# EAGLE design MainBoard (EAGLE 9.6.2)
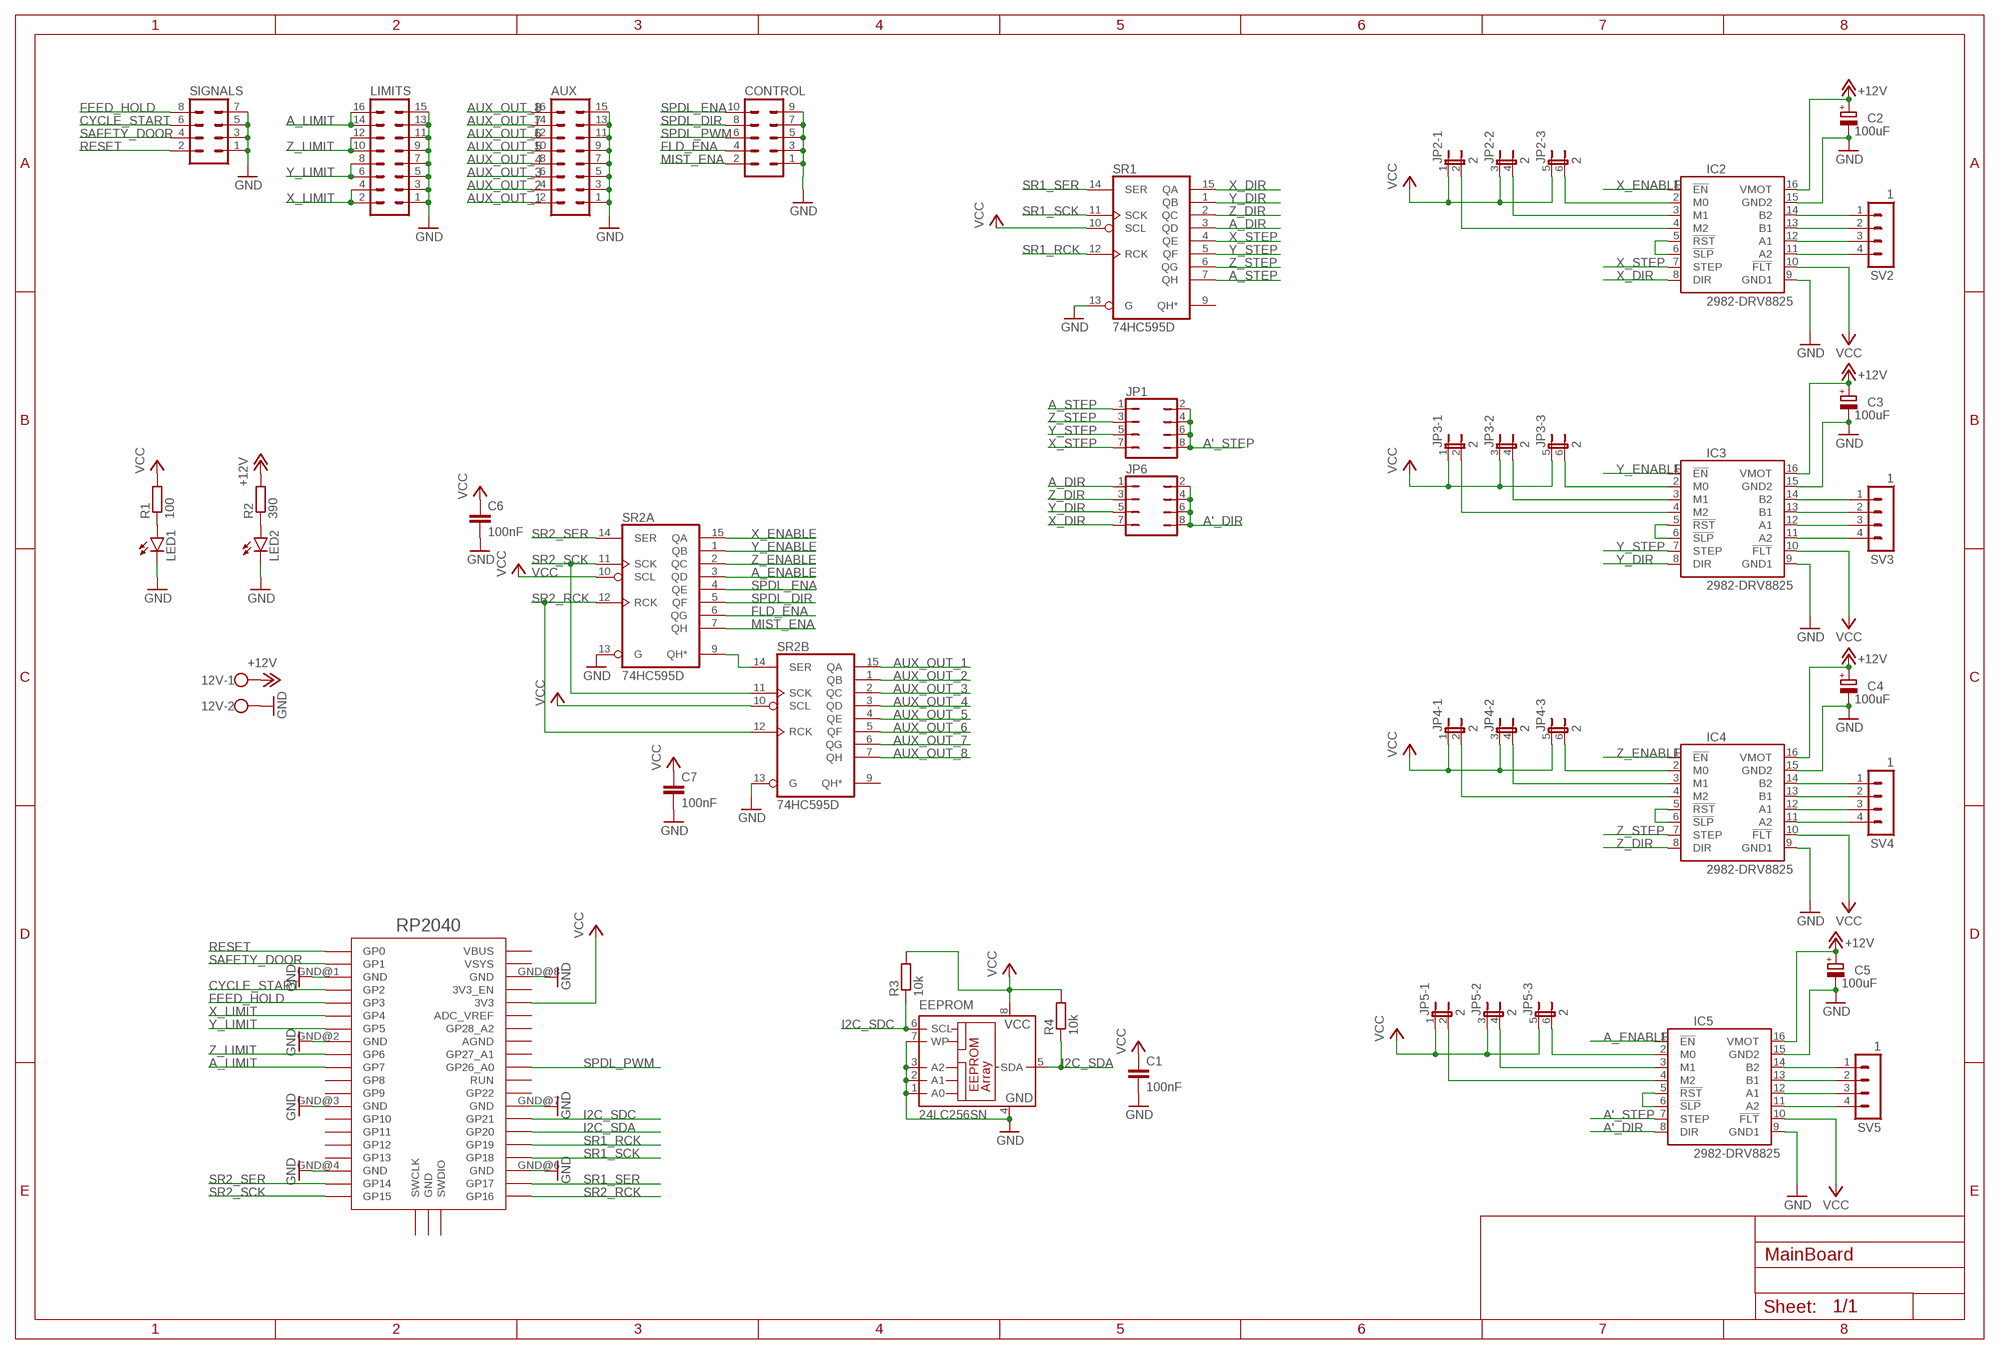
[diagram p0: schematic, sheet 1]

## Parts
12V  W237-102  [W237-102]
AUX  MA08-2  [MA08-2]
C1  100nF  C-EUC0805  [C0805]
C2  100uF  CPOL-EUE3.5-8  [E3,5-8]
C3  100uF  CPOL-EUE3.5-8  [E3,5-8]
C4  100uF  CPOL-EUE3.5-8  [E3,5-8]
C5  100uF  CPOL-EUE3.5-8  [E3,5-8]
C6  100nF  C-EUC0805  [C0805]
C7  100nF  C-EUC0805  [C0805]
CONTROL  MA05-2  [MA05-2]
EEPROM  24LC256SN  [SO-08]
IC2  2982-DRV8825  [DRV8825]
IC3  2982-DRV8825  [DRV8825]
IC4  2982-DRV8825  [DRV8825]
IC5  2982-DRV8825  [DRV8825]
JP1  JP4Q  [JP4Q]
JP2  2  JP3QE  [JP3Q]
JP3  2  JP3QE  [JP3Q]
JP4  2  JP3QE  [JP3Q]
JP5  2  JP3QE  [JP3Q]
JP6  JP4Q  [JP4Q]
LED1  LEDCHIP-LED0805  [CHIP-LED0805]
LED2  LEDCHIP-LED0805  [CHIP-LED0805]
LIMITS  MA08-2  [MA08-2]
R1  100  R-EU_R0805  [R0805]
R2  390  R-EU_R0805  [R0805]
R3  10k  R-EU_R0805  [R0805]
R4  10k  R-EU_R0805  [R0805]
RP2040  RPI_PICO_IG-TH  [RPI_PICO_TH]
SIGNALS  MA04-2  [MA04-2]
SR1  74HC595D  [SO16]
SR2A  74HC595D  [SO16]
SR2B  74HC595D  [SO16]
SV2  1  MA04-1  [MA04-1]
SV3  1  MA04-1  [MA04-1]
SV4  1  MA04-1  [MA04-1]
SV5  1  MA04-1  [MA04-1]

## Nets
+12V [VCC_12]: 12V.1 C2.+ C3.+ C4.+ C5.+ IC2.16(VMOT) IC3.16(VMOT) IC4.16(VMOT) IC5.16(VMOT) R2.2
A'_DIR: IC5.8(DIR) JP6.2 JP6.4 JP6.6 JP6.8
A'_STEP: IC5.7(STEP) JP1.2 JP1.4 JP1.6 JP1.8
A_DIR: JP6.1 SR1.3(QD)
A_ENABLE: IC5.1(!EN) SR2A.3(QD)
A_LIMIT: LIMITS.14 LIMITS.16 RP2040.GP7
A_STEP: JP1.1 SR1.7(QH)
AUX_OUT_1: AUX.2 SR2B.15(QA)
AUX_OUT_2: AUX.4 SR2B.1(QB)
AUX_OUT_3: AUX.6 SR2B.2(QC)
AUX_OUT_4: AUX.8 SR2B.3(QD)
AUX_OUT_5: AUX.10 SR2B.4(QE)
AUX_OUT_6: AUX.12 SR2B.5(QF)
AUX_OUT_7: AUX.14 SR2B.6(QG)
AUX_OUT_8: AUX.16 SR2B.7(QH)
CYCLE_START: RP2040.GP2 SIGNALS.6
FEED_HOLD: RP2040.GP3 SIGNALS.8
FLD_ENA: CONTROL.4 SR2A.6(QG)
GND: 12V.2 AUX.1 AUX.3 AUX.5 AUX.7 AUX.9 AUX.11 AUX.13 AUX.15 C1.2 C2.- C3.- C4.- C5.- C6.2 C7.2 CONTROL.1 CONTROL.3 CONTROL.5 CONTROL.7 CONTROL.9 EEPROM.1(A0) EEPROM.2(A1) EEPROM.3(A2) EEPROM.4(GND) EEPROM.7(WP) IC2.9(GND1) IC2.15(GND2) IC3.9(GND1) IC3.15(GND2) IC4.9(GND1) IC4.15(GND2) IC5.9(GND1) IC5.15(GND2) LED1.C LED2.C LIMITS.1 LIMITS.3 LIMITS.5 LIMITS.7 LIMITS.9 LIMITS.11 LIMITS.13 LIMITS.15 RP2040.GND@1(GND) RP2040.GND@2(GND) RP2040.GND@3(GND) RP2040.GND@4(GND) RP2040.GND@6(GND) RP2040.GND@7(GND) RP2040.GND@8(GND) SIGNALS.1 SIGNALS.3 SIGNALS.5 SIGNALS.7 SR1.13(G) SR2A.13(G) SR2B.13(G)
I2C_SDA: EEPROM.5(SDA) R4.1 RP2040.GP20
I2C_SDC: EEPROM.6(SCL) R3.1 RP2040.GP21
M0-X: IC2.2(M0) JP2.6
M1-X: IC2.3(M1) JP2.4
M2-X: IC2.4(M2) JP2.2
MIST_ENA: CONTROL.2 SR2A.7(QH)
N$1: SR2A.9(QH*) SR2B.14(SER)
N$2: LED1.A R1.1
N$3: LED2.A R2.1
N$6 [Stepper]: IC2.14(B2) SV2.1
N$7 [Stepper]: IC2.13(B1) SV2.2
N$8 [Stepper]: IC2.12(A1) SV2.3
N$12 [Stepper]: IC2.11(A2) SV2.4
N$16: IC2.5(!RST) IC2.6(!SLP)
N$18 [Stepper]: IC3.14(B2) SV3.1
N$19 [Stepper]: IC3.13(B1) SV3.2
N$20 [Stepper]: IC3.12(A1) SV3.3
N$21 [Stepper]: IC3.11(A2) SV3.4
N$22: IC3.2(M0) JP3.6
N$23: IC3.3(M1) JP3.4
N$24: IC3.4(M2) JP3.2
N$25: IC3.5(!RST) IC3.6(!SLP)
N$26 [VCC_12]: IC4.14(B2) SV4.1
N$27 [Stepper]: IC4.13(B1) SV4.2
N$28 [Stepper]: IC4.12(A1) SV4.3
N$29 [Stepper]: IC4.11(A2) SV4.4
N$30: IC4.2(M0) JP4.6
N$31: IC4.3(M1) JP4.4
N$32: IC4.4(M2) JP4.2
N$33: IC4.5(!RST) IC4.6(!SLP)
N$34 [Stepper]: IC5.14(B2) SV5.1
N$35 [Stepper]: IC5.13(B1) SV5.2
N$36: IC5.12(A1) SV5.3
N$37 [Stepper]: IC5.11(A2) SV5.4
N$38: IC5.2(M0) JP5.6
N$39: IC5.3(M1) JP5.4
N$40: IC5.4(M2) JP5.2
N$41: IC5.5(!RST) IC5.6(!SLP)
RESET: RP2040.GP0 SIGNALS.2
SAFETY_DOOR: RP2040.GP1 SIGNALS.4
SPDL_DIR: CONTROL.8 SR2A.5(QF)
SPDL_ENA: CONTROL.10 SR2A.4(QE)
SPDL_PWM: CONTROL.6 RP2040.GP26_A0
SR1_RCK: RP2040.GP19 SR1.12(RCK)
SR1_SCK: RP2040.GP18 SR1.11(SCK)
SR1_SER: RP2040.GP17 SR1.14(SER)
SR2_RCK: RP2040.GP16 SR2A.12(RCK) SR2B.12(RCK)
SR2_SCK: RP2040.GP15 SR2A.11(SCK) SR2B.11(SCK)
SR2_SER: RP2040.GP14 SR2A.14(SER)
VCC [VCC_5]: C1.1 C6.1 C7.1 EEPROM.8(VCC) IC2.10(!FLT) IC3.10(!FLT) IC4.10(!FLT) IC5.10(!FLT) JP2.1 JP2.3 JP2.5 JP3.1 JP3.3 JP3.5 JP4.1 JP4.3 JP4.5 JP5.1 JP5.3 JP5.5 R1.2 R3.2 R4.2 RP2040.3V3 SR1.10(SCL) SR2A.10(SCL) SR2B.10(SCL)
X_DIR: IC2.8(DIR) JP6.7 SR1.15(QA)
X_ENABLE: IC2.1(!EN) SR2A.15(QA)
X_LIMIT: LIMITS.2 LIMITS.4 RP2040.GP4
X_STEP: IC2.7(STEP) JP1.7 SR1.4(QE)
Y_DIR: IC3.8(DIR) JP6.5 SR1.1(QB)
Y_ENABLE: IC3.1(!EN) SR2A.1(QB)
Y_LIMIT: LIMITS.6 LIMITS.8 RP2040.GP5
Y_STEP: IC3.7(STEP) JP1.5 SR1.5(QF)
Z_DIR: IC4.8(DIR) JP6.3 SR1.2(QC)
Z_ENABLE: IC4.1(!EN) SR2A.2(QC)
Z_LIMIT: LIMITS.10 LIMITS.12 RP2040.GP6
Z_STEP: IC4.7(STEP) JP1.3 SR1.6(QG)
Unconnected: RP2040.3V3_EN RP2040.ADC_VREF RP2040.AGND RP2040.GND@5(GND) RP2040.GP8 RP2040.GP9 RP2040.GP10 RP2040.GP11 RP2040.GP12 RP2040.GP13 RP2040.GP22 RP2040.GP27_A1 RP2040.GP28_A2 RP2040.RUN RP2040.SWCLK RP2040.SWDIO RP2040.VBUS RP2040.VSYS SR1.9(QH*) SR2B.9(QH*)

## Power pins joined to a net without a drawn wire
GND: SR1.8(GND) SR2A.8(GND) SR2B.8(GND)
VCC: SR1.16(VCC) SR2A.16(VCC) SR2B.16(VCC)

## Library data of the parts
12V = con-wago-500:W237-102: WAGO SCREW CLAMP; MPN: 237-102; OC_FARNELL: unknown; OC_NEWARK: 70K9898
AUX LIMITS = con-lstb:MA08-2: PIN HEADER; OC_FARNELL: unknown; OC_NEWARK: unknown
C1 C6 C7 = rcl:C-EU: CAPACITOR, European symbol; SPICEPREFIX: C
C2-C5 = rcl:CPOL-EU: POLARIZED CAPACITOR, European symbol; SPICEPREFIX: C
CONTROL = con-lstb:MA05-2: PIN HEADER; OC_FARNELL: unknown; OC_NEWARK: unknown
EEPROM = microchip:24*: Serial EEPROM I2C; MF: MICROCHIP; MPN: 24LC256-I/SN; OC_FARNELL: 9757996; OC_NEWARK: 27C9144
IC2-IC5 = pololu-stepper-driver:2982-DRV8825: DRV8825 Stepper Motor Driver Carrier; High Current (Header Pins Soldered) #2982 DRV8825 Stepper Motor Driver Carrier; High Current (Header Pins Soldered) <https://www.pololu.com/product/2982> in Japan, Suzaku Lab. Ltd. <https://suzakugiken.jp/> #2982 DRV8825 大電流用ステッピングモータドライバ (ピンヘッダ実装済み) <https://szc.jp/po2982>
JP1 JP6 = jumper:JP4Q: JUMPER
JP2-JP5 = jumper:JP3QE: JUMPER
LED1 LED2 = led:LED: LED OSRAM: - CHIPLED LG R971, LG N971, LY N971, LG Q971, LY Q971, LO R971, LY R971 LH N974, LH R974 LS Q976, LO Q976, LY Q976 LO Q996 - Hyper CHIPLED LW Q18S LB Q993, LB Q99A, LB R99A - SideLED LS A670, LO A670, LY A670, LG A670, LP A670 LB A673, LV A673, LT A673, LW A673 LH A674 LY A675 LS A676, LA A676, LO A676, LY A676, LW A676 LS A679, LY A679, LG A679 - Hyper Micro SIDELED® LS Y876, LA Y876, LO Y876, LY Y876 LT Y87S - SmartLED LW L88C, LW L88S LB L89C, LB L89S, LG L890 LS L89K, LO L89K, LY L89K LS L896, LA L896, LO L896, LY L896 - TOPLED LS T670, LO T670, LY T670, LG T670, LP T670 LSG T670, LSP T670, LSY T670, LOP T670, LYG T670 LG T671, LOG T671, LSG T671 LB T673, LV T673, LT T673, LW T673 LH T674 LS T676, LA T676, LO T676, LY T676, LB T676, LH T676, LSB T676, LW T676 LB T67C, LV T67C, LT T67C, LS T67K, LO T67K, LY T67K, LW E67C LS E67B, LA E67B, LO E67B, LY E67B, LB E67C, LV E67C, LT E67C LW T67C LS T679, LY T679, LG T679 LS T770, LO T770, LY T770, LG T770, LP T770 LB T773, LV T773, LT T773, LW T773 LH T774 LS E675, LA E675, LY E675, LS T675 LS T776, LA T776, LO T776, LY T776, LB T776 LHGB T686 LT T68C, LB T68C - Hyper Mini TOPLED® LB M676 - Mini TOPLED Santana® LG M470 LS M47K, LO M47K, LY M47K Source: http://www.osram.convergy.de LUXEON: - LUMILED® LXK2-PW12-R00, LXK2-PW12-S00, LXK2-PW14-U00, LXK2-PW14-V00 LXK2-PM12-R00, LXK2-PM12-S00, LXK2-PM14-U00 LXK2-PE12-Q00, LXK2-PE12-R00, LXK2-PE12-S00, LXK2-PE14-T00, LXK2-PE14-U00 LXK2-PB12-K00, LXK2-PB12-L00, LXK2-PB12-M00, LXK2-PB14-N00, LXK2-PB14-P00, LXK2-PB14-Q00 LXK2-PR12-L00, LXK2-PR12-M00, LXK2-PR14-Q00, LXK2-PR14-R00 LXK2-PD12-Q00, LXK2-PD12-R00, LXK2-PD12-S00 LXK2-PH12-R00, LXK2-PH12-S00 LXK2-PL12-P00, LXK2-PL12-Q00, LXK2-PL12-R00 Source: www.luxeon.com KINGBRIGHT: KA-3528ASYC Source: www.kingbright.com
R1-R4 = rcl:R-EU_: RESISTOR, European symbol; SPICEPREFIX: R
RP2040 = RaspberryPi_Pico:RPI_PICO_IG
SIGNALS = con-lstb:MA04-2: PIN HEADER; OC_FARNELL: unknown; OC_NEWARK: unknown
SR1 SR2A SR2B = 74xx-eu:74*595: 8-bit SHIFT REGISTER, output latch
SV2-SV5 = con-lstb:MA04-1: PIN HEADER; OC_FARNELL: unknown; OC_NEWARK: unknown

## Net classes
0 default: drill 0.305 mm, clearance 0.152 mm
1 VCC_12: width 1.016 mm, drill 0.305 mm, clearance 0.508 mm to class 0, clearance 0.152 mm
2 Stepper: width 1.016 mm, drill 0.305 mm, clearance 0.508 mm to class 0, clearance 0.508 mm to class 1, clearance 0.152 mm
3 VCC_5: width 0.254 mm, drill 0.305 mm, clearance 0.152 mm to class 0, clearance 0.508 mm to class 1, clearance 0.508 mm to class 2, clearance 0.152 mm

## Board
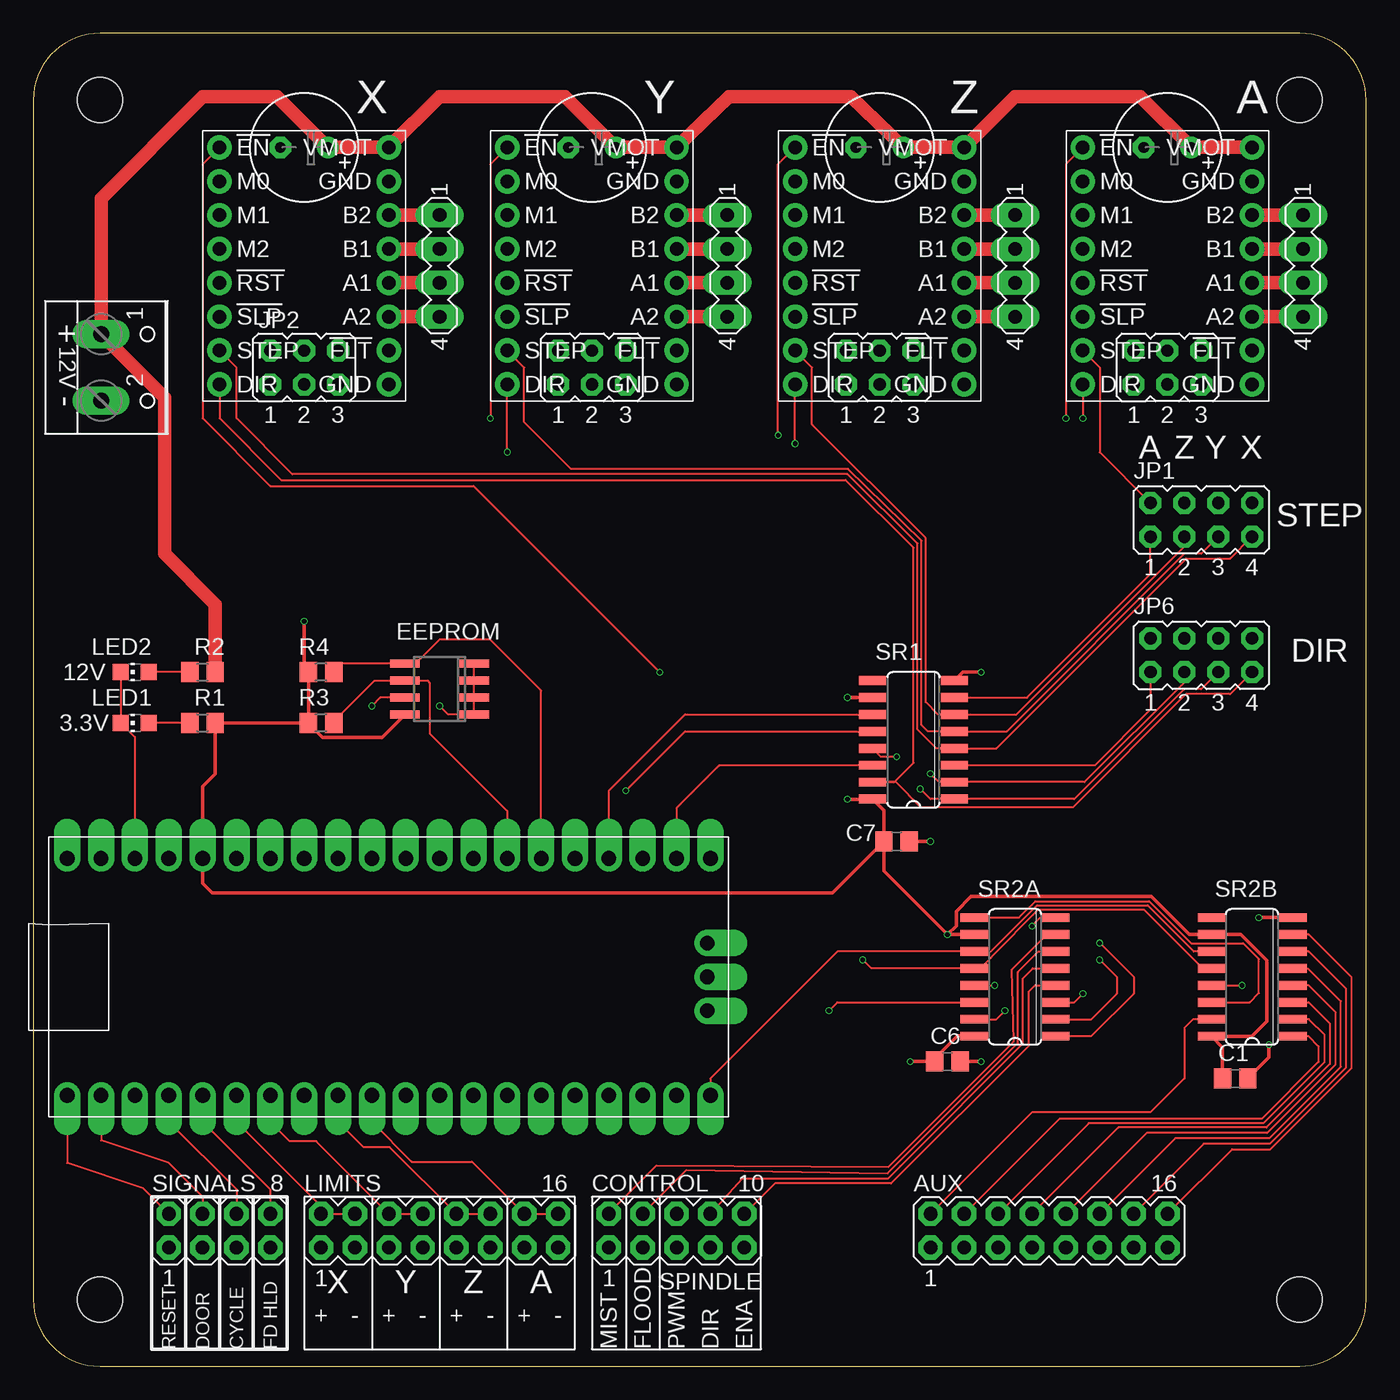
[diagram p1: board, top side]
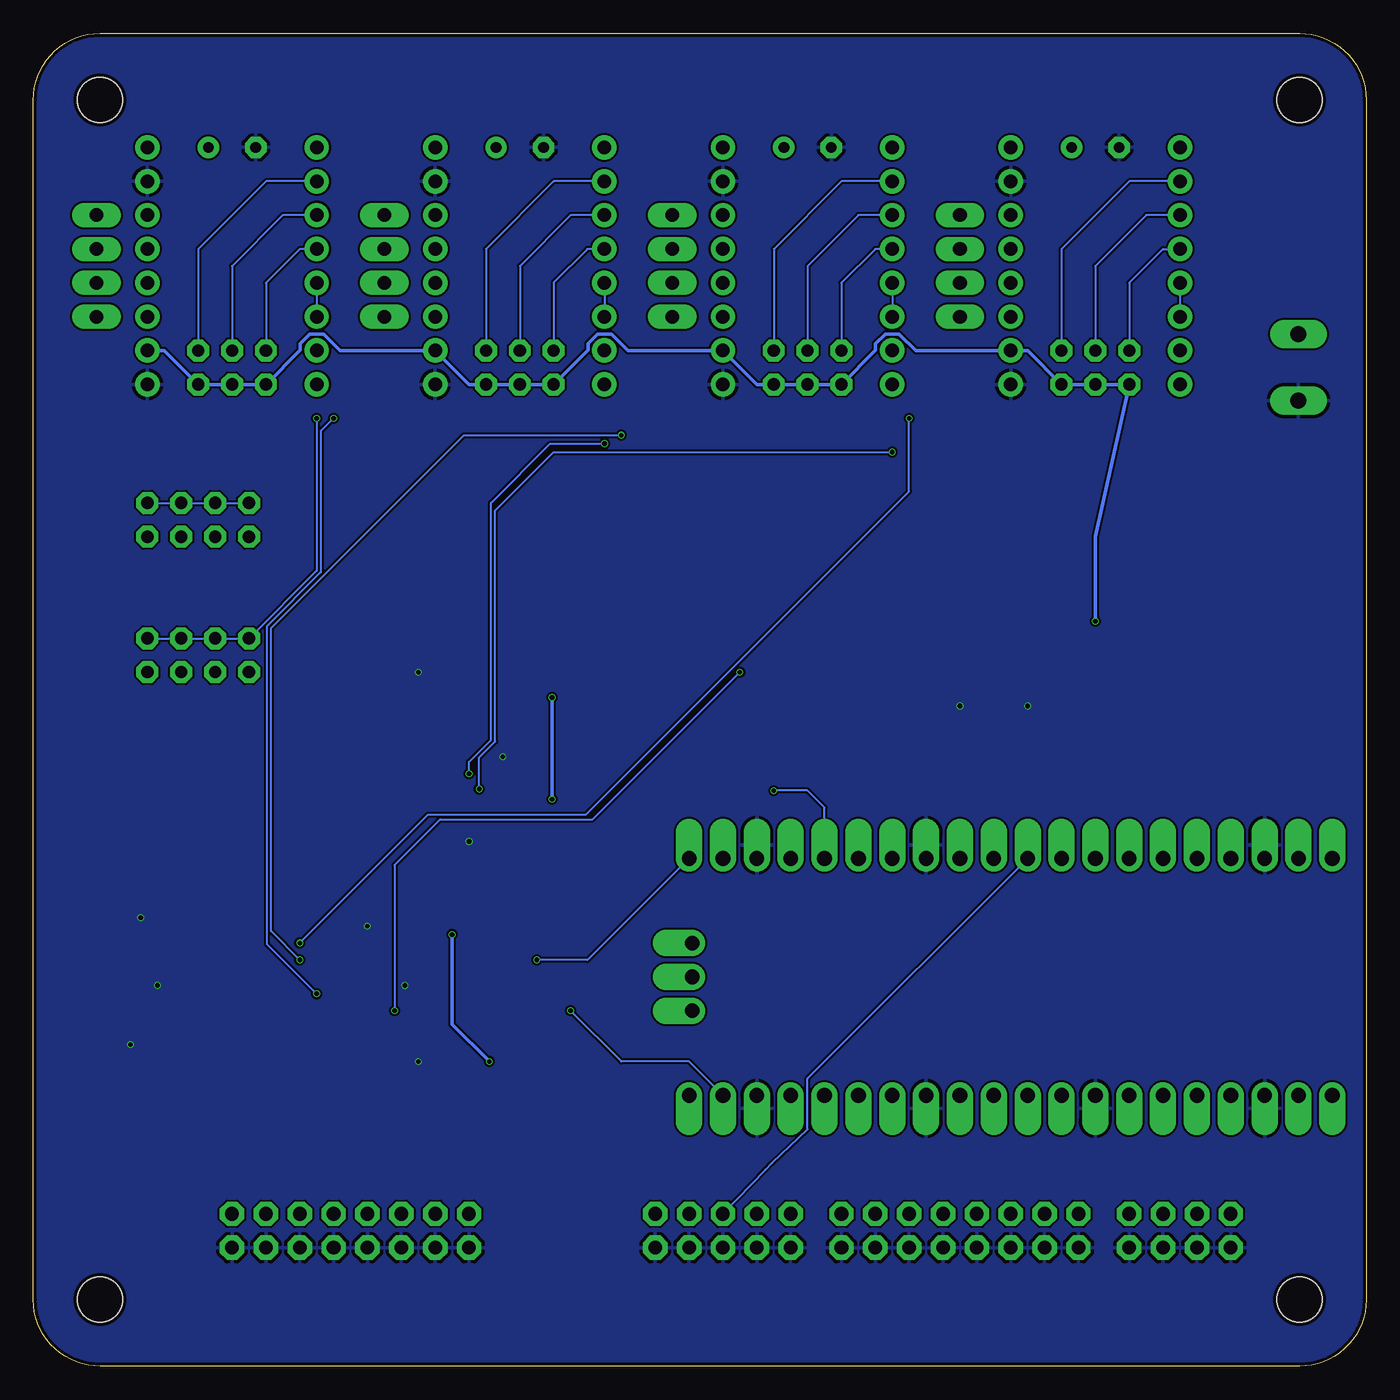
[diagram p2: board, bottom side, seen from below]

Size 100 x 100 mm. Coordinates in mm from the lower left corner, seen from the top.
Outline: 0,95 0,5 arc90 5,0 95,0 95.44,0.02 arc85 100,5 100,95 99.98,95.44 arc85 95,100 5,100 4.56,99.98 arc85 0,95
Copper layers (1*16): Top 0.035mm / dielectric 1.6mm / Bottom 0.035mm
Design rules "hugo-2layers *": minimum track width 6mil, minimum drill 0.3mm, track to track 5mil, track to pad 8mil, pad to pad 10mil, via to via 10mil, smd to smd 6mil, copper to edge 10mil, drill to drill 10mil, minimum pad ring 10mil, minimum via ring 3mil, stop-mask expansion 4mil, vias tented up to drill 0mil, thermal gap 10mil
Holes 3.4 mm at 5,95 95,95 95,5 5,5

### Footprints (pad centres in the part's own frame; a part is rotated, then mirrored left to right if it is on the bottom)
W237-102 = drill 1.194 long: 1 -2.5,-1.27; 2 2.5,-1.27
MA08-2 = drill 1.016 octagon: 1 -8.89,-1.27; 2 -8.89,1.27; 3 -6.35,-1.27; 4 -6.35,1.27; 5 -3.81,-1.27; 6 -3.81,1.27; 7 -1.27,-1.27; 8 -1.27,1.27; 9 1.27,-1.27; 10 1.27,1.27; 11 3.81,-1.27; 12 3.81,1.27; 13 6.35,-1.27; 14 6.35,1.27; 15 8.89,-1.27; 16 8.89,1.27
C0805 = smd 1.3 x 1.5: 1 -0.95,0; 2 0.95,0
E3,5-8 = drill 0.813 pad 1.6: + -1.778,0 | drill 0.813 pad 1.6 octagon: - 1.778,0
MA05-2 = drill 1.016 octagon: 1 -5.08,-1.27; 2 -5.08,1.27; 3 -2.54,-1.27; 4 -2.54,1.27; 5 0,-1.27; 6 0,1.27; 7 2.54,-1.27; 8 2.54,1.27; 9 5.08,-1.27; 10 5.08,1.27
SO-08 = smd 0.6 x 2.2: 1 -1.905,-2.6; 2 -0.635,-2.6; 3 0.635,-2.6; 4 1.905,-2.6; 5 1.905,2.6; 6 0.635,2.6; 7 -0.635,2.6; 8 -1.905,2.6
DRV8825 = drill 1.016: 1 -6.35,8.89; 2 -6.35,6.35; 3 -6.35,3.81; 4 -6.35,1.27; 5 -6.35,-1.27; 6 -6.35,-3.81; 7 -6.35,-6.35; 8 -6.35,-8.89; 9 6.35,-8.89; 10 6.35,-6.35; 11 6.35,-3.81; 12 6.35,-1.27; 13 6.35,1.27; 14 6.35,3.81; 15 6.35,6.35; 16 6.35,8.89
JP4Q = drill 0.914 octagon: 1 -3.81,-1.27; 2 -3.81,1.27; 3 -1.27,-1.27; 4 -1.27,1.27; 5 1.27,-1.27; 6 1.27,1.27; 7 3.81,-1.27; 8 3.81,1.27
JP3Q = drill 0.914 octagon: 1 -2.54,-1.27; 2 -2.54,1.27; 3 0,-1.27; 4 0,1.27; 5 2.54,-1.27; 6 2.54,1.27
CHIP-LED0805 = smd 1.2 x 1.2: A 0,-1.05; C 0,1.05
R0805 = smd 1.3 x 1.5: 1 -0.95,0; 2 0.95,0
RPI_PICO_TH = drill 1.1 pad 1.6 offset: 3V3 8.89,13.97; 3V3_EN 8.89,16.51; ADC_VREF 8.89,11.43; AGND 8.89,6.35; GND@1 -8.89,19.05; GND@2 -8.89,6.35; GND@3 -8.89,-6.35; GND@4 -8.89,-19.05; GND@5 0,-23.9; GND@6 8.89,-19.05; GND@7 8.89,-6.35; GND@8 8.89,19.05; GP0 -8.89,24.13; GP1 -8.89,21.59; GP2 -8.89,16.51; GP3 -8.89,13.97; GP4 -8.89,11.43; GP5 -8.89,8.89; GP6 -8.89,3.81; GP7 -8.89,1.27; GP8 -8.89,-1.27; GP9 -8.89,-3.81; GP10 -8.89,-8.89; GP11 -8.89,-11.43; GP12 -8.89,-13.97; GP13 -8.89,-16.51; GP14 -8.89,-21.59; GP15 -8.89,-24.13; GP16 8.89,-24.13; GP17 8.89,-21.59; GP18 8.89,-16.51; GP19 8.89,-13.97; GP20 8.89,-11.43; GP21 8.89,-8.89; GP22 8.89,-3.81; GP26_A0 8.89,1.27; GP27_A1 8.89,3.81; GP28_A2 8.89,8.89; RUN 8.89,-1.27; SWCLK -2.54,-23.9; SWDIO 2.54,-23.9; VBUS 8.89,24.13; VSYS 8.89,21.59
MA04-2 = drill 1.016 octagon: 1 -3.81,-1.27; 2 -3.81,1.27; 3 -1.27,-1.27; 4 -1.27,1.27; 5 1.27,-1.27; 6 1.27,1.27; 7 3.81,-1.27; 8 3.81,1.27
SO16 = smd 0.66 x 2.032: 1 -4.445,-3.073; 2 -3.175,-3.073; 3 -1.905,-3.073; 4 -0.635,-3.073; 5 0.635,-3.073; 6 1.905,-3.073; 7 3.175,-3.073; 8 4.445,-3.073; 9 4.445,3.073; 10 3.175,3.073; 11 1.905,3.073; 12 0.635,3.073; 13 -0.635,3.073; 14 -1.905,3.073; 15 -3.175,3.073; 16 -4.445,3.073
MA04-1 = drill 1.016 long: 1 -3.81,0; 2 -1.27,0; 3 1.27,0; 4 3.81,0

### Placement (x,y rotation side)
12V  6.35,74.93 270 top
AUX  76.2,10.16 0 top
C1  90.17,21.59 0 top
C2  20.32,91.44 180 top
C3  41.91,91.44 180 top
C4  63.5,91.44 180 top
C5  85.09,91.44 180 top
C6  68.58,22.86 0 top
C7  64.77,39.37 0 top
CONTROL  48.26,10.16 0 top
EEPROM  30.48,50.8 90 top
IC2  20.32,82.55 0 top
IC3  41.91,82.55 0 top
IC4  63.5,82.55 0 top
IC5  85.09,82.55 0 top
JP1  87.63,63.5 0 top
JP2  20.32,74.93 0 top
JP3  41.91,74.93 0 top
JP4  63.5,74.93 0 top
JP5  85.09,74.93 0 top
JP6  87.63,53.34 0 top
LED1  7.62,48.26 90 top
LED2  7.62,52.07 90 top
LIMITS  30.48,10.16 0 top
R1  12.7,48.26 0 top
R2  12.7,52.07 0 top
R3  21.59,48.26 180 top
R4  21.59,52.07 180 top
RP2040  26.67,29.21 90 top
SIGNALS  13.97,10.16 0 top
SR1  66.04,46.99 90 top
SR2A  73.66,29.21 90 top
SR2B  91.44,29.21 90 top
SV2  30.48,82.55 270 top
SV3  52.07,82.55 270 top
SV4  73.66,82.55 270 top
SV5  95.25,82.55 270 top

### Tracks (layer width: path | path; a pad name or v marks a point on that pad's centre or on a via)
+12V
  Top 1.016: R2.2 13.65,57.15 9.84,60.96 9.84,72.67 12V.1 5.08,87.59 12.7,95.25 18.29,95.25 C2.+ IC2.16 30.48,95.25 39.88,95.25 C3.+ IC3.16 52.2,95.25 61.34,95.25 C4.+ IC4.16 73.66,95.25 83.06,95.25 C5.+ IC5.16
A'_DIR  (via drill 0.35)
  Top 0.152: IC5.8 v78.74,71.12
  Bottom 0.152: JP6.8 JP6.6 JP6.4 JP6.2 78.74,59.69 v78.74,71.12
A'_STEP
  Top 0.152: IC5.7 80.01,74.93 80.01,68.58 JP1.2
  Bottom 0.152: JP1.8 JP1.6 JP1.4 JP1.2
A_DIR
  Top 0.152: JP6.1 83.82,49.28 79.63,45.09 SR1.3
A_ENABLE  (via drill 0.35)
  Top 0.152: SR2A.3 78.11,27.3 v78.74,27.94 | IC5.1 77.47,90.17 v77.47,71.12
  Bottom 0.152: v78.74,27.94 82.49,31.69 82.49,55.51 78.44,59.56 78.44,70.16 v77.47,71.12
A_LIMIT
  Top 0.152: LIMITS.16 LIMITS.14 32.92,15.34 28.4,15.34 25.4,18.34 RP2040.GP7
A_STEP
  Top 0.152: SR1.7 74.55,50.16 83.82,59.44 JP1.1
AUX_OUT_1
  Top 0.152: AUX.2 74.93,19.05 83.82,19.05 86.36,21.59 86.36,25.4 87,26.04 SR2B.15
AUX_OUT_2
  Top 0.152: AUX.4 76.99,18.57 92.17,18.57 96.42,22.82 96.42,24 95.66,24.77 SR2B.1
AUX_OUT_3
  Top 0.152: AUX.6 79.19,18.23 92.27,18.23 96.88,22.84 96.88,24.87 95.71,26.04 SR2B.2
AUX_OUT_4
  Top 0.152: SR2B.3 95.69,27.3 97.28,25.71 97.28,22.67 92.52,17.91 81.41,17.91 AUX.8
AUX_OUT_5
  Top 0.152: AUX.10 83.54,17.5 92.56,17.5 97.69,22.62 97.69,26.57 95.68,28.57 SR2B.4
AUX_OUT_6
  Top 0.152: AUX.12 85.67,17.09 92.73,17.09 98.09,22.46 98.09,27.37 95.64,29.82 94.54,29.82 SR2B.5
AUX_OUT_7
  Top 0.152: AUX.14 87.81,16.69 92.77,16.69 98.5,22.41 98.5,28.3 95.69,31.11 SR2B.6
AUX_OUT_8
  Top 0.152: AUX.16 89.94,16.28 92.81,16.28 98.91,22.37 98.91,29.17 95.69,32.38 SR2B.7
CYCLE_START
  Top 0.152: RP2040.GP2 10.16,18.34 15.24,13.26 SIGNALS.6
FEED_HOLD
  Top 0.152: RP2040.GP3 12.7,18.34 17.78,13.26 SIGNALS.8
FLD_ENA
  Top 0.152: CONTROL.4 49.01,14.71 64.08,14.46 73.87,24.25 73.87,29.58 75.41,31.11 SR2A.6
GND  (via drill 0.35)
  Top 0.152: EEPROM.4 EEPROM.3 EEPROM.2 EEPROM.1 31.11,48.9 v30.48,49.53 | LED2.C LED1.C 7.62,47.21 RP2040.GND@8 | SR2A.8 75.56,33.66 v74.93,33.02 | SR2B.13 v90.68,28.57 | EEPROM.7 26.04,50.16 v25.4,49.53 | SR1.13 63.6,45.72 v64.77,45.72 | SR2A.13 v72.14,28.57
  Top 0.254: SR1.8 69.75,52.07 v71.12,52.07 | C6.2 v71.12,22.86 | C7.2 v67.31,39.37 | SR2B.8 v91.95,33.66 | C1.2 92.71,23.18 v92.71,24.13
  pour Bottom: 0,100.33 100.33,100.33 100.33,0 0,0
I2C_SDA
  Top 0.152: R4.1 23.18,52.7 EEPROM.5 28.68,52.7 30.48,54.5 34.27,54.5 38.1,50.68 RP2040.GP20
I2C_SDC
  Top 0.152: R3.1 22.54,48.36 25.61,51.44 EEPROM.6 29.6,51.44 29.75,51.29 29.75,47.48 35.56,41.67 RP2040.GP21
M0-X
  Bottom 0.152: IC2.2 17.78,88.9 22.86,83.82 JP2.6
M1-X
  Bottom 0.152: IC2.3 16.51,86.36 20.32,82.55 JP2.4
M2-X
  Bottom 0.152: IC2.4 15.24,83.82 17.78,81.28 JP2.2
MIST_ENA
  Top 0.152: CONTROL.2 43.16,11.46 46.76,15.06 64.14,14.95 73.56,24.36 73.43,29.77 76.05,32.38 SR2A.7
N$1
  Top 0.152: SR2A.9 73.95,33.66 75.17,34.87 83.73,34.87 86.88,31.73 90.77,31.73 91.95,30.55 91.95,28 91.25,27.3 SR2B.14
N$2
  Top 0.152: R1.1 LED1.A
N$3
  Top 0.152: R2.1 LED2.A
N$6
  Top 1.016: IC2.14 SV2.1
N$7
  Top 1.016: IC2.13 SV2.2
N$8
  Top 1.016: IC2.12 SV2.3
N$12
  Top 1.016: IC2.11 SV2.4
N$16
  Bottom 0.152: IC2.5 IC2.6
N$18
  Top 1.016: IC3.14 SV3.1
N$19
  Top 1.016: IC3.13 SV3.2
N$20
  Top 1.016: IC3.12 SV3.3
N$21
  Top 1.016: IC3.11 SV3.4
N$22
  Bottom 0.152: IC3.2 39.37,88.9 44.45,83.82 JP3.6
N$23
  Bottom 0.152: IC3.3 38.1,86.36 41.91,82.55 JP3.4
N$24
  Bottom 0.152: IC3.4 36.83,83.82 39.37,81.28 JP3.2
N$25
  Bottom 0.152: IC3.5 IC3.6
N$26
  Top 1.016: IC4.14 SV4.1
N$27
  Top 1.016: IC4.13 SV4.2
N$28
  Top 1.016: IC4.12 SV4.3
N$29
  Top 1.016: IC4.11 SV4.4
N$30
  Bottom 0.152: IC4.2 60.96,88.9 66.04,83.82 JP4.6
N$31
  Bottom 0.152: IC4.3 59.69,86.36 63.5,82.55 JP4.4
N$32
  Bottom 0.152: JP4.2 60.96,81.28 58.42,83.82 IC4.4
N$33
  Bottom 0.152: IC4.5 IC4.6
N$34
  Top 1.016: IC5.14 SV5.1
N$35
  Top 1.016: IC5.13 SV5.2
N$36
  Top 1.016: IC5.12 SV5.3
N$37
  Top 1.016: IC5.11 SV5.4
N$38
  Bottom 0.152: IC5.2 82.55,88.9 87.63,83.82 JP5.6
N$39
  Bottom 0.152: JP5.4 85.09,82.55 81.28,86.36 IC5.3
N$40
  Bottom 0.152: IC5.4 80.01,83.82 82.55,81.28 JP5.2
N$41
  Bottom 0.152: IC5.5 IC5.6
RESET
  Top 0.152: RP2040.GP0 2.54,15.24 8.26,13.34 SIGNALS.2
SAFETY_DOOR
  Top 0.152: RP2040.GP1 5.08,16.93 10.16,15.24 12.7,12.7 SIGNALS.4
SPDL_DIR
  Top 0.152: CONTROL.8 53.21,14.1 64.15,14.1 65.05,15 65.14,15.08 65.14,15.09 74.26,24.2 74.26,29.11 74.99,29.84 SR2A.5
SPDL_ENA
  Top 0.152: CONTROL.10 55.63,13.72 64.36,13.72 74.69,24.04 74.69,28.11 75.16,28.57 SR2A.4
SPDL_PWM
  Bottom 0.152: RP2040.GP26_A0 41.91,21.59 41.91,17.78 44.58,15.24 45.09,14.73 CONTROL.6
SR1_RCK  (via drill 0.35)
  Top 0.152: v44.45,43.18 48.9,47.62 SR1.12
  Bottom 0.152: RP2040.GP19 40.64,41.91 41.91,43.18 v44.45,43.18
SR1_SCK
  Top 0.152: RP2040.GP18 43.18,43.18 48.9,48.9 SR1.11
SR1_SER
  Top 0.152: SR1.14 62.94,45.06 51.44,45.06 48.26,41.88 RP2040.GP17
SR2_RCK  (via drill 0.35)
  Top 0.152: SR2B.12 87.73,29.84 83.31,34.27 75.42,34.27 71.88,30.72 71.88,30.67 71.06,29.84 SR2A.12 62.87,29.84 v62.23,30.48
  Bottom 0.152: RP2040.GP16 58.42,30.48 v62.23,30.48
SR2_SCK
  Top 0.152: SR2B.11 87.06,31.11 83.6,34.57 75.3,34.57 71.84,31.11 SR2A.11 60.33,31.11 50.8,21.59 RP2040.GP15
SR2_SER  (via drill 0.35)
  Top 0.152: v59.69,26.67 60.33,27.3 SR2A.14
  Bottom 0.152: RP2040.GP14 50.8,22.86 55.88,22.86 v59.69,26.67
VCC  (via drill 0.35)
  Top 0.254: R3.2 R1.2 13.65,44.45 12.7,43.5 RP2040.3V3 12.7,36.23 13.42,35.51 59.96,35.51 C7.1 | R3.2 R4.2 20.32,52.39 v20.32,55.88 | C7.1 63.82,41.69 SR1.16 62.94,42.52 61.11,42.52 v61.09,42.55 | SR2A.16 69.32,24.77 67.63,23.08 C6.1 v65.79,22.86 | C7.1 63.82,37.15 v68.58,32.38 | R3.2 21.72,47.18 26.16,47.18 EEPROM.8 | v68.58,32.38 SR2A.10 | SR1.10 v61.09,50.16 | v68.58,32.38 69.24,33.05 69.24,34.12 70.35,35.23 83.88,35.23 86.72,32.38 SR2B.10 90.61,32.38 92.56,30.44 92.56,25.87 91.42,24.74 88.39,24.74 SR2B.16 89.22,23.91 C1.1
  Bottom 0.254: v20.32,55.88 20.32,62.23 JP2.1 JP2.3 JP2.5 25.4,76.2 IC2.10 33.8,76.2 35.04,77.44 36.08,77.44 36.8,76.72 36.8,76.22 JP3.1 JP3.3 JP3.5 45.72,73.66 IC3.10 55.39,76.2 56.63,77.44 57.67,77.44 58.4,76.72 58.4,76.22 JP4.1 JP4.3 JP4.5 67.31,73.66 IC4.10 76.98,76.2 78.22,77.44 79.26,77.44 79.98,76.72 79.98,76.22 JP5.1 JP5.3 JP5.5 90.17,76.2 IC5.10 | v68.58,32.38 68.58,25.65 v65.79,22.86 | v61.09,50.16 v61.09,42.55
X_DIR
  Top 0.152: IC2.8 13.97,71.12 18.59,66.5 60.95,66.5 66.04,61.41 66.04,45.27 64.61,43.84 62.99,43.84 SR1.15 64.72,43.81 66.6,41.94 78,41.94 86.49,50.42 89.79,50.42 JP6.7
X_ENABLE  (via drill 0.35)
  Top 0.152: v46.99,52.07 33.02,66.04 17.78,66.04 12.7,71.12 12.7,90.17 IC2.1 | SR2A.15 72.26,26.04 v72.9,26.67
  Bottom 0.152: v46.99,52.07 58.04,41.02 69.47,41.02 72.9,37.59 v72.9,26.67
X_LIMIT
  Top 0.152: LIMITS.4 LIMITS.2 21.59,11.99 15.24,18.34 RP2040.GP4
X_STEP
  Top 0.152: IC2.7 15.24,74.93 15.24,71.12 19.43,66.93 61.08,66.93 66.34,61.72 66.34,47.75 67.75,46.35 SR1.4 72.25,46.35 86.49,60.6 88.9,60.6 89,60.6 89.79,60.6 91.42,62.23 JP1.7
Y_DIR  (via drill 0.35)
  Top 0.152: v66.55,43.31 67.31,42.55 SR1.1 78.11,42.55 86.36,50.8 87.63,50.8 JP6.5 | v35.56,68.58 IC3.8
  Bottom 0.152: v66.55,43.31 66.55,45.67 65.35,46.86 65.35,64.19 60.96,68.58 v35.56,68.58
Y_ENABLE  (via drill 0.35)
  Top 0.152: SR2A.1 79.38,24.77 82.55,27.94 82.55,29.21 v80.01,31.75 | IC3.1 34.29,90.17 v34.29,71.12
  Bottom 0.152: v80.01,31.75 70.38,41.38 58.53,41.38 34.29,65.62 v34.29,71.12
Y_LIMIT
  Top 0.152: LIMITS.8 LIMITS.6 21.22,16.88 19.24,16.88 17.78,18.34 RP2040.GP5
Y_STEP
  Top 0.152: JP1.5 87.63,60.96 86.36,60.96 73.03,47.62 SR1.5 67.12,47.62 66.65,48.09 66.65,61.92 61.12,67.31 40.35,67.31 36.83,70.83 36.83,74.93 IC3.7
Z_DIR  (via drill 0.35)
  Top 0.152: v67.31,44.45 67.94,43.81 SR1.2 78.87,43.81 86.36,51.31 JP6.3 | v57.15,69.22 IC4.8
  Bottom 0.152: v67.31,44.45 67.31,45.34 65.66,46.99 65.66,64.77 61.21,69.22 v57.15,69.22
Z_ENABLE  (via drill 0.35)
  Top 0.152: SR2A.2 79.38,26.04 81.28,27.94 81.28,29.21 v80.01,30.48 | IC4.1 55.88,90.17 v55.88,69.85
  Bottom 0.152: v80.01,30.48 82.17,32.64 82.17,55.37 67.69,69.85 v55.88,69.85
Z_LIMIT
  Top 0.152: LIMITS.12 LIMITS.10 26.75,16.43 24.77,16.43 22.86,18.34 RP2040.GP6
Z_STEP
  Top 0.152: IC4.7 58.42,74.93 58.42,70.65 66.95,62.13 66.95,49.82 67.88,48.9 SR1.6 73.77,48.9 86.36,61.48 JP1.3

### Text on the board
tNames: X | Y | Z | A | + | 12V | - | A | Z | Y | X | STEP | DIR | 12V | 3.3V | X | Y | Z | A | SPINDLE | + | - | + | - | + | - | + | - | RESET | DOOR | CYCLE | FD HLD | MIST | FLOOD | PWM | DIR | ENA